# Altium schematic sheet Power&CAN.SchDoc
size A4
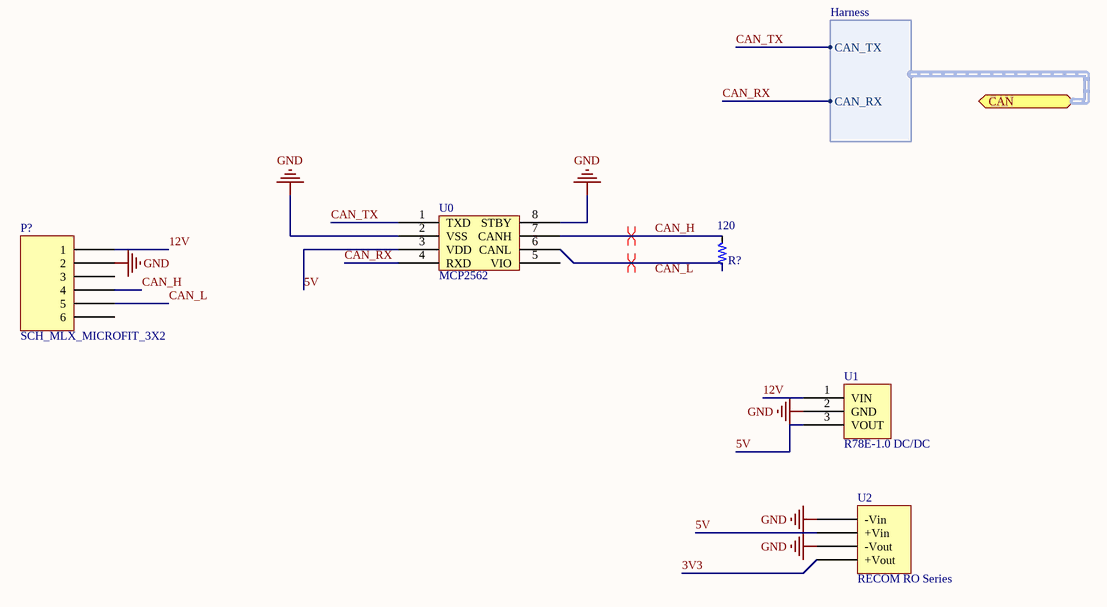
[diagram p0: Power&CAN.SchDoc]

## Parts
P?  SCH_MLX_MICROFIT_3X2  [PCB_MLX_MICROFIT_3X2]
R?  Resistance: 120  [PCB_GENERIC_SMD_0603]  (hidden comment: SCH_GENERIC_RESISTOR_0603)
U0  MCP2562  [SOIC127P600X175-8N]
U1  R78E-1.0 DC/DC  [R78-1.0]
U2  RECOM RO Series  [RECOM RO Series 1W DCDC]

## Ports
CAN (harness Harness)

## Harnesses
Harness: CAN_TX, CAN_RX

## Nets
GND: P?.2 U0.2(VSS) U0.8(STBY) U1.2(GND) U2.1(-Vin) U2.3(-Vout)
3V3: U2.4(+Vout)
5V: U0.3(VDD) U1.3(VOUT) U2.2(+Vin)
12V: P?.1 U1.1(VIN)
CAN_H: P?.4 R?.2 U0.7(CANH)
CAN_L: P?.5
CAN_RX: U0.4(RXD) ; port CAN.CAN_RX
CAN_TX: U0.1(TXD) ; port CAN.CAN_TX
NetR?_1: R?.1 U0.6(CANL)

Not connected (* = marked no-connect by the designer): P? 3 6; U0 5(VIO)

## Layout directives
differential pair: CAN_H, NetR?_1

## Notes on the sheet
- Labels drawn without touching a wire or pin: CAN_L

## Library data of the parts
R? = SCH_GENERIC_RESISTOR_0603: Generic SMD resistor 0603
U0 = MCP2562: 1/1 Transceiver Full CAN 8-SOIC
U1 = R78E-1.0
U2 = RECOM RO Series DCDC Converter